# EasyEDA Pro project SchadenDeck.eprj, board Mainboard
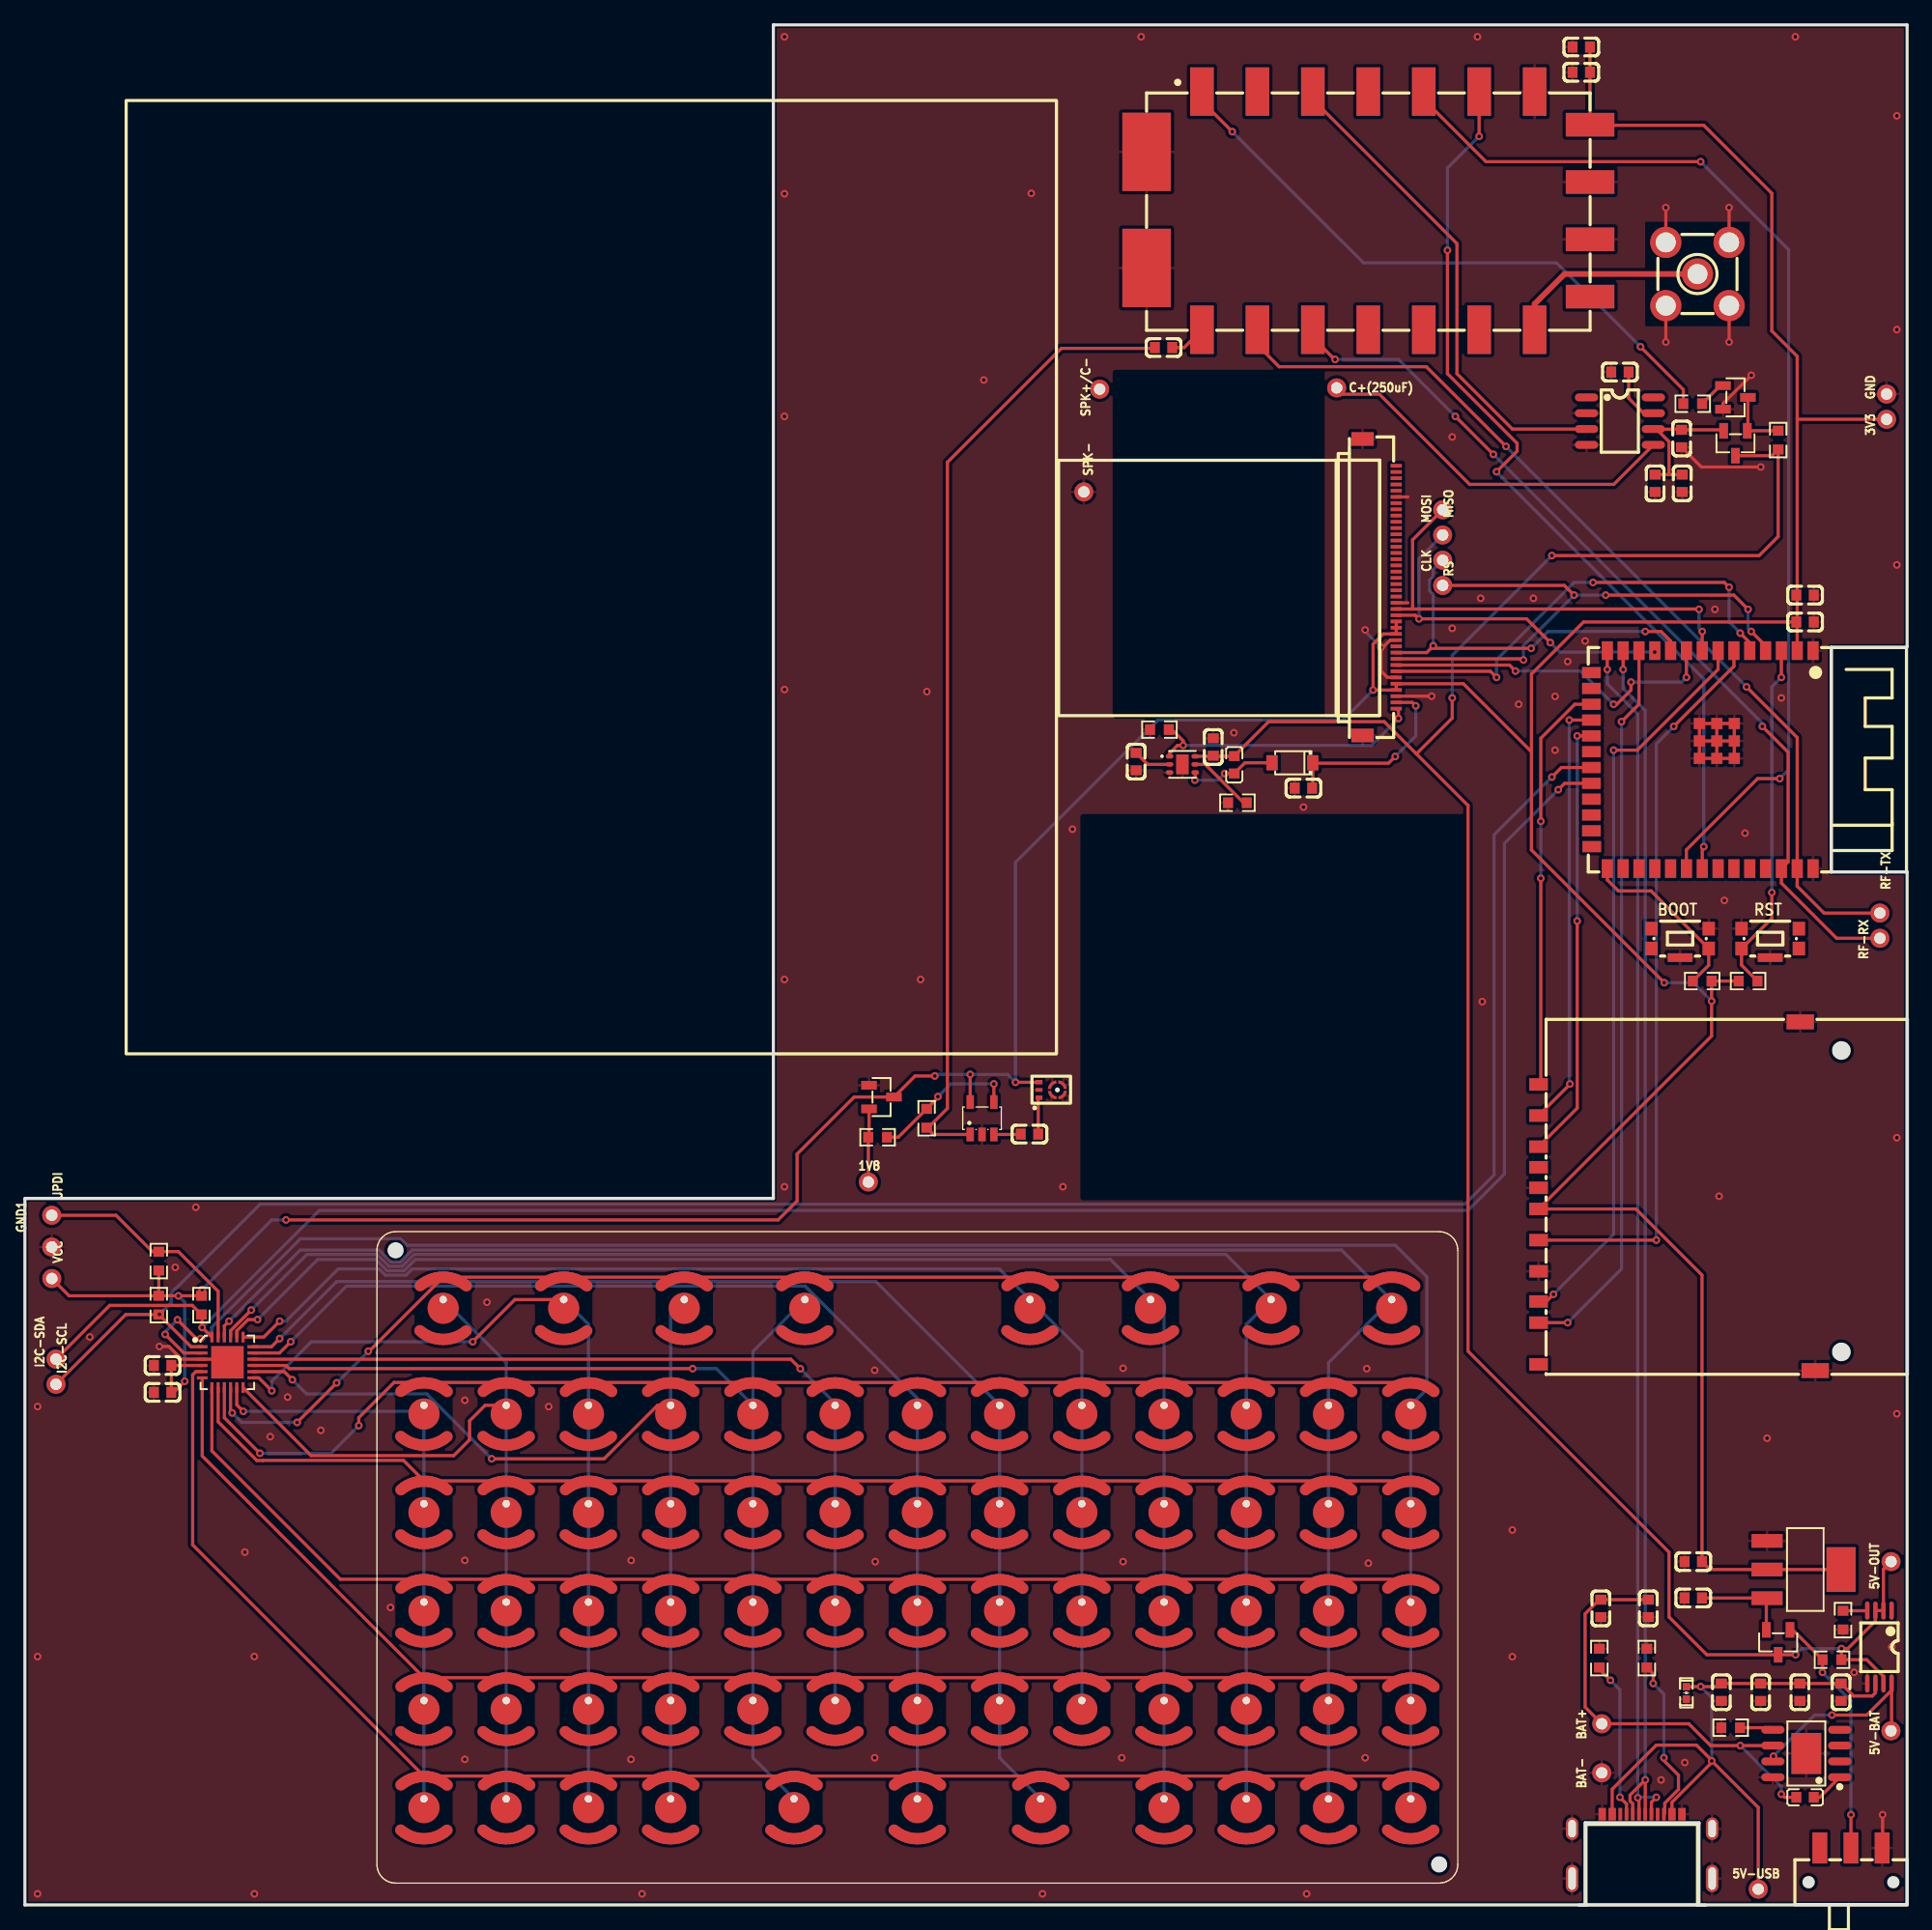
[diagram p4: board, top side]
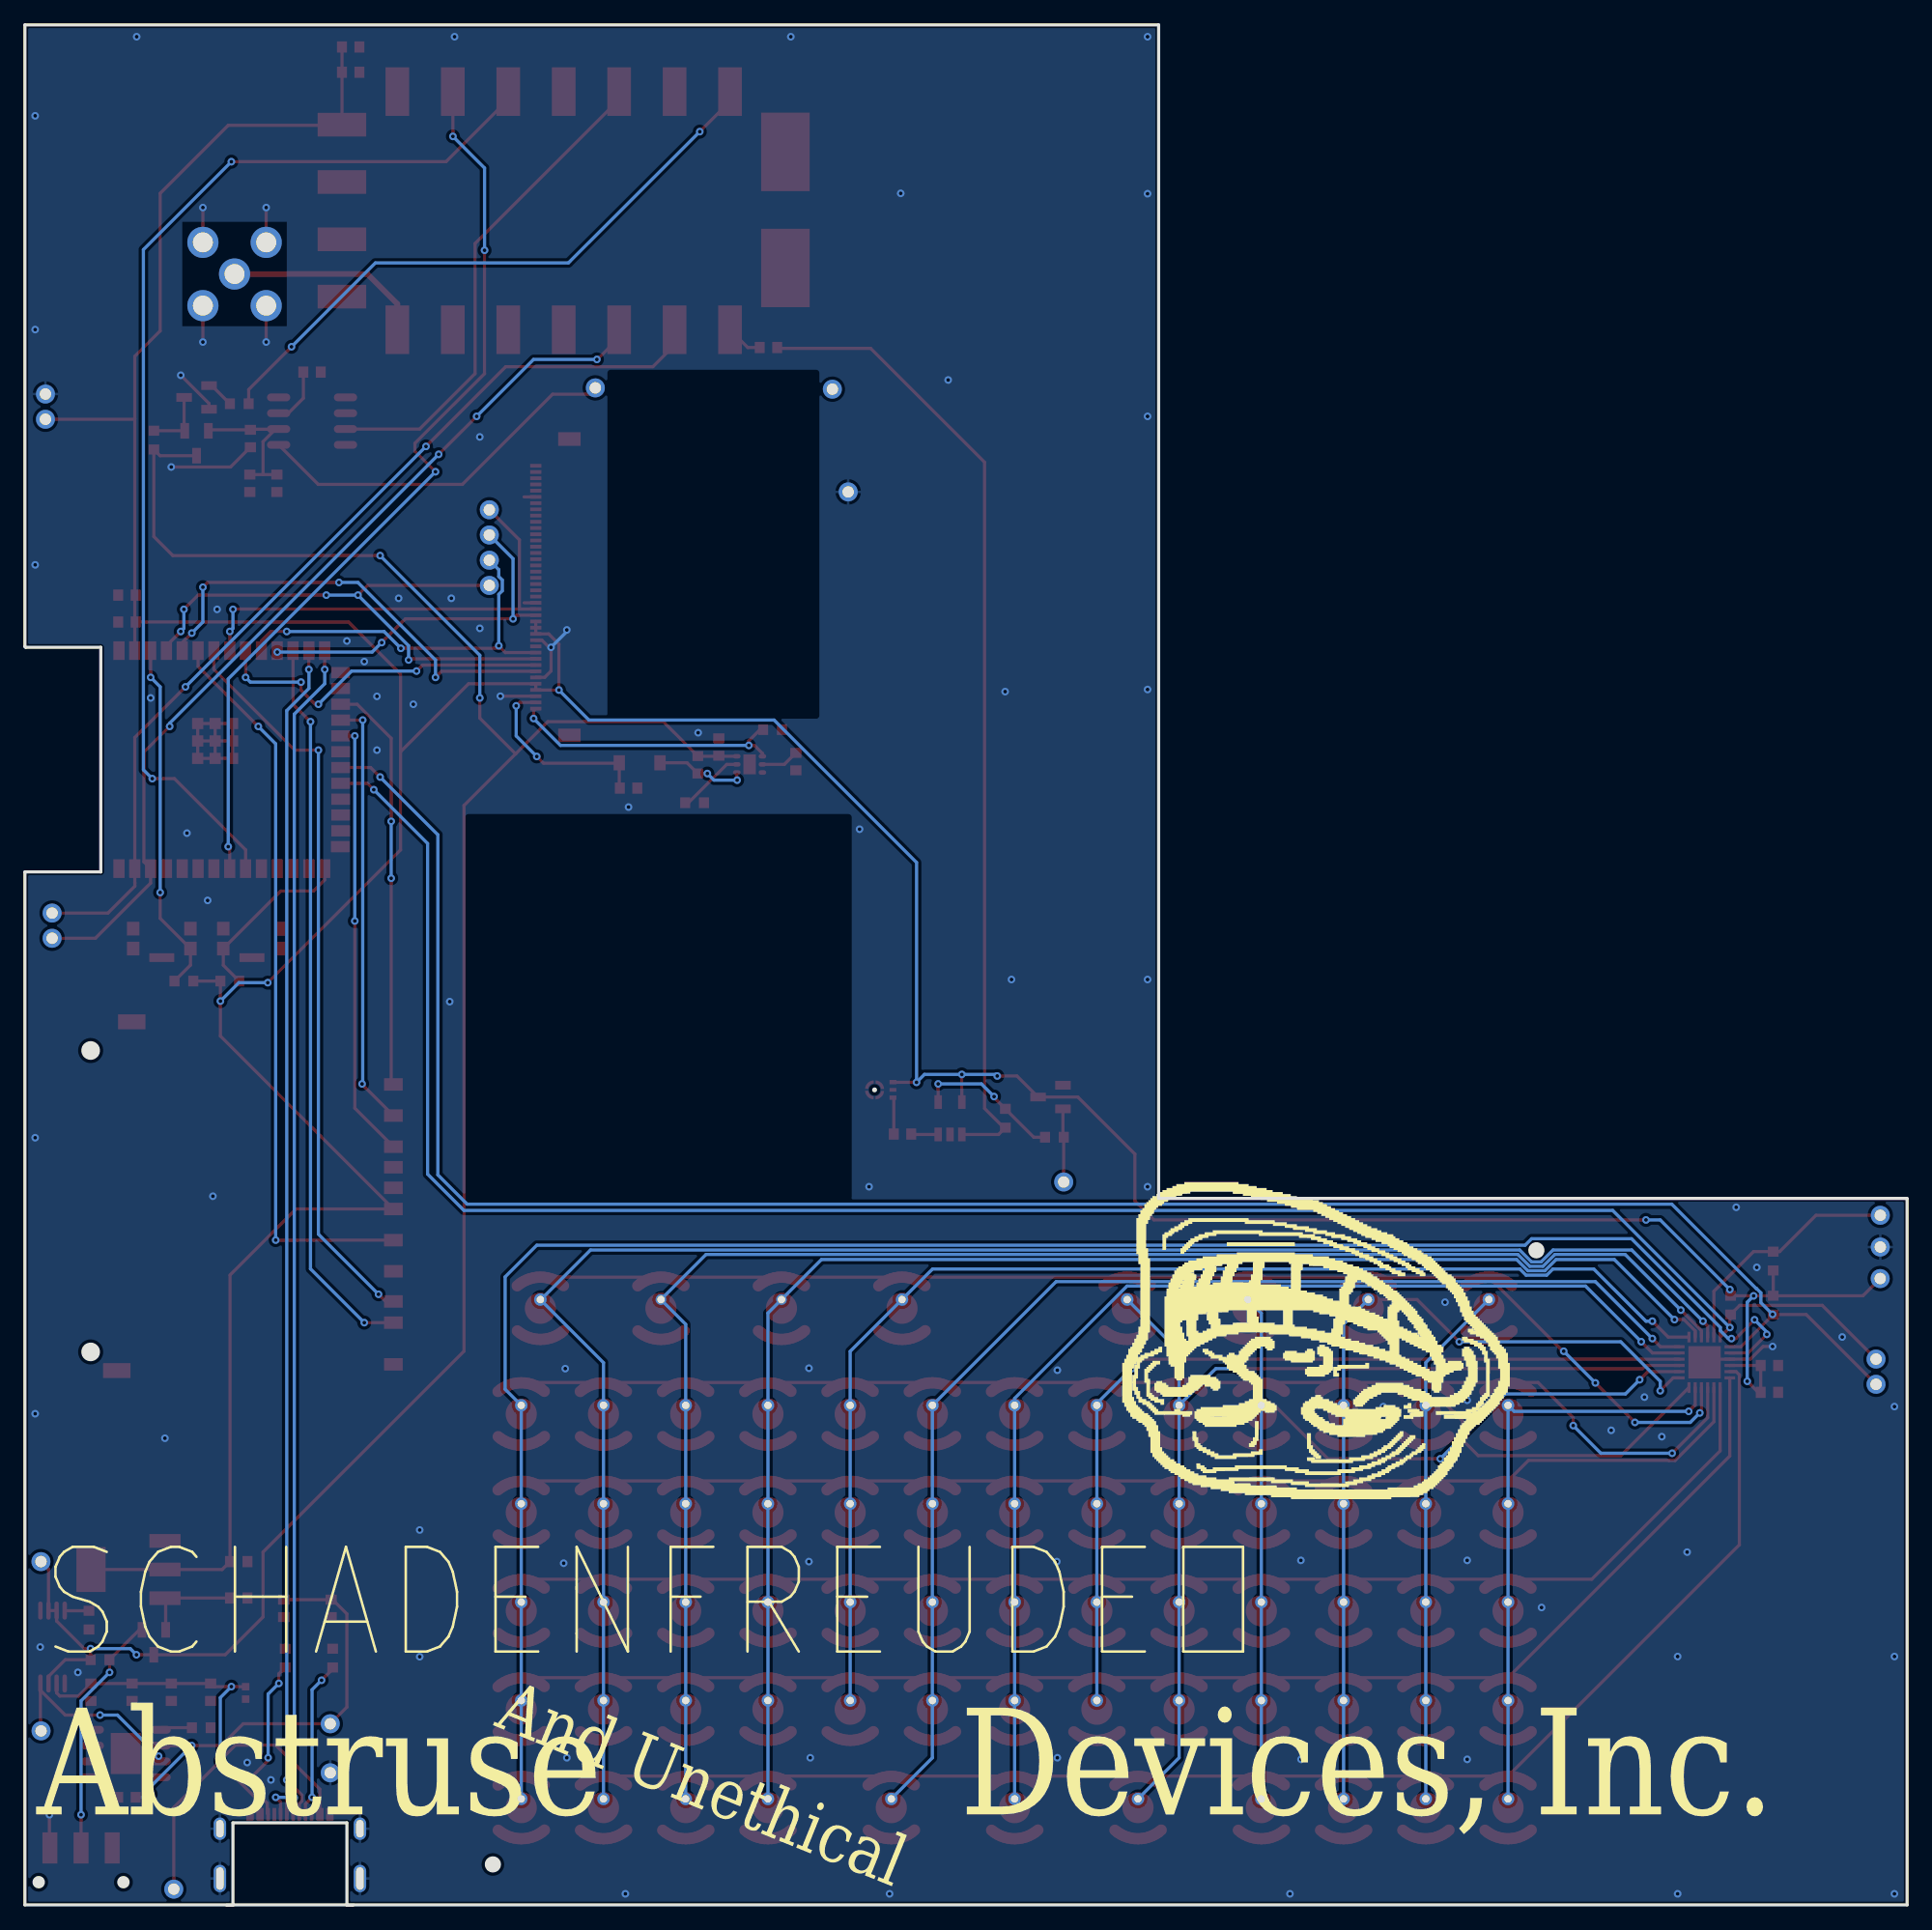
[diagram p5: board, bottom side, seen from below]

Outline 151.06 x 150.95 mm; copper layers: Top Layer, Bottom Layer. Coordinates in mm from the lower left corner of the outline.
Outline path: 0,56.73 60.07,56.73 60.07,150.95 151.06,150.95 151.06,101.04 151,100.98 144.97,100.98 144.97,82.95 151.06,82.95 151.06,0.02 0,0.02 0,56.73
Stack: Top Layer 0.035mm / Dielectric1 1.51mm FR4 er 4.5 / Bottom Layer 0.035mm

## Design rules (mm)
template: JLCPCB Capability(Two Layers Board)
spacing copperThickness1oz (default): track to track 0.102, other pairs 0.152 to 0.3
spacing copperThickness2oz: track to track 0.203, other pairs 0.152 to 0.3
track width copperThickness1oz (default): min 0.127, default 0.254, max 2.54
track width copperThickness2oz: min 0.203, default 0.254, max 2.54
differential pair differentialPair (default): width min 0.127, default 0.254, max 2.54; gap min 0.152, default 0.152
via viaSize (default): diameter min 0.5, default 0.61, max 10; hole min 0.3, default 0.305, max 6.3

## Placement (name value [footprint] x y rotation side)
1V8  PAD  [SMD_BD4.0-L4.0-W4.0-D1.0]  67.69 58.06 0 top
3V3  PAD  [SMD_BD4.0-L4.0-W4.0-D1.0]  149.42 119.29 90 top
5V-BAT  PAD  [SMD_BD4.0-L4.0-W4.0-D1.0]  149.77 13.99 90 top
5V-OUT  PAD  [SMD_BD4.0-L4.0-W4.0-D1.0]  149.78 27.58 180 top
5V-USB  PAD  [SMD_BD4.0-L4.0-W4.0-D1.0]  139.12 1.28 90 top
BAT+  PAD  [SMD_BD4.0-L4.0-W4.0-D1.0]  126.56 14.56 90 top
BAT-  PAD  [SMD_BD4.0-L4.0-W4.0-D1.0]  126.56 10.62 90 top
BOOT  KMR221GLFS  [KEY-SMD_KMR2XXGXXX]  132.84 77.23 180 top
C46  100nF  [C0603]  136.16 17.09 270 top
C47  100nF  [C0603]  139.31 17.09 270 top
C48  10uF  [C0603]  142.46 17.09 270 top
C49  10uF  [C0603]  145.76 17.09 270 top
C50  10uF  [C0603]  130.29 23.82 90 top
C51  10uF  [C0603]  126.48 23.82 90 top
C55  10uF  [C0603]  133.9 27.58 180 top
C56  10uF  [C0603]  133.9 24.66 180 top
C57  4.7uF  [C0603]  95.37 92.98 90 top
C58  1uF  [C0603]  102.62 89.68 180 top
C59  220nF  [C0603]  89.19 91.81 270 top
C60  10uF  [C0603]  142.88 105.17 180 top
C61  1uF  [C0603]  142.88 103.01 180 top
C63  0.1uF  [C0603]  124.92 149.18 180 top
C64  4.7uF  [C0603]  124.92 147.15 180 top
C65  1uF  [C0603]  91.39 125.05 0 top
C66  1uF  [C0603]  80.63 61.9 180 top
C67  100nF  [C0603]  11.05 43.32 180 top
C68  1uF  [C0603]  11.05 41.16 180 top
C69  10uF  [C0603]  128.02 123.08 180 top
C70  100nF  [C0603]  132.97 117.75 90 top
C71  22uF  [C0603]  130.84 114.15 270 top
C72  22uF  [C0603]  133.02 114.15 270 top
C+(250uF)  PAD  [SMD_BD4.0-L4.0-W4.0-D1.0]  105.28 121.81 180 top
CLK  PAD  [SMD_BD4.0-L4.0-W4.0-D1.0]  113.79 107.98 90 top
D2  SLESDPSA0402V05  [D0402-BI]  133.35 17.03 270 top
D5  MBR0540T1G  [SOD-123_L2.7-W1.6-LS3.7-RD]  101.73 91.71 180 top
FPC1  FPC40-T1T1-2021-A  [FPC-SMD_FPC40-T1T1-2021-A]  108.71 105.81 270 top
GND  PAD  [SMD_BD4.0-L4.0-W4.0-D1.0]  149.42 121.31 90 top
GND1  PAD  [SMD_BD4.0-L4.0-W4.0-D1.0]  2.15 52.83 90 top
I2C-SCL  PAD  [SMD_BD4.0-L4.0-W4.0-D1.0]  2.49 41.81 270 top
I2C-SDA  PAD  [SMD_BD4.0-L4.0-W4.0-D1.0]  2.49 43.84 90 top
L3  1uH  [L0603]  142.88 8.65 0 top
L4  10uH  [L0603]  97.06 91.55 270 top
MISO  PAD  [SMD_BD4.0-L4.0-W4.0-D1.0]  113.79 110 270 top
MOSI  PAD  [SMD_BD4.0-L4.0-W4.0-D1.0]  113.79 112.02 90 top
Q1  IRLML6402  [SOT-23-3_L2.9-W1.3-P0.95-LS2.4-BR]  137.29 117.36 90 top
Q2  MMBT3904  [SOT-23-3_L2.9-W1.3-P1.90-LS2.4-BR]  137.29 121.05 180 top
Q3  IRLML6402  [SOT-23-3_L2.9-W1.3-P0.95-LS2.4-BR]  140.72 21.1 90 top
R50  91K  [R0603]  136.91 14.24 0 top
R51  5.1K  [R0603]  126.37 19.83 270 top
R52  5.1K  [R0603]  130.18 19.83 270 top
R59  10K  [R0603]  138.3 74.19 180 top
R60  10K  [R0603]  134.62 74.19 0 top
R61  6.8  [R0603]  91.06 94.38 0 top
R62  100K  [R0603]  97.31 88.5 0 top
R64  68K  [R0603]  72.37 63.17 90 top
R65  10K  [R0603]  68.43 61.65 180 top
R67  4.7K  [R0603]  10.74 48.17 90 top
R69  4.7K  [R0603]  14.17 48.17 90 top
R70  10K  [R0603]  133.86 120.54 180 top
R71  100K  [R0603]  140.72 117.62 270 top
R72  10K  [R0603]  10.74 51.71 270 top
R73  100K  [R0603]  145.03 19.7 0 top
R74  430  [R0603]  145.92 22.88 90 top
RF-RX  PAD  [SMD_BD4.0-L4.0-W4.0-D1.0]  148.88 77.62 90 top
RF-TX  PAD  [SMD_BD4.0-L4.0-W4.0-D1.0]  148.88 79.65 270 top
RS  PAD  [SMD_BD4.0-L4.0-W4.0-D1.0]  113.79 105.95 270 top
RST  KMR221GLFS  [KEY-SMD_KMR2XXGXXX]  140.08 77.23 180 top
SPK+/C-  PAD  [SMD_BD4.0-L4.0-W4.0-D1.0]  86.26 121.71 90 top
SPK-  PAD  [SMD_BD4.0-L4.0-W4.0-D1.0]  84.99 113.46 270 top
SW1  JS102011SAQN  [SW-SMD_JS102011SAQN]  146.56 4.59 0 top
U1  ESPS3-32-N16R8  [WIRELM-SMD_ESP32-S3-WROOM-1]  134.62 91.96 270 top
U2  -  [KeebDeck_Keyboard_6R13C]  71.63 27.58 0 top
U8  ETA9740E8A  [ESOP-8_L4.9-W3.9-P1.27-LS6.0-BL-EP-1]  142.97 12.17 90 top
U11  10067847-001RLF  [SD-SMD_10067847-001RLF]  132.59 56.91 90 top
U14  AMS1117-3.3  [SOT-223-3_L6.5-W3.4-P2.30-LS7.0-BR]  142.79 26.94 180 top
U15  TPS61165DRVR  [WSON-6_L2.0-W2.0-P0.65-TL-EP]  92.9 91.58 0 top
U16  MCP1700T-1802E/TT  [SOT-23-3_L2.9-W1.3-P1.90-LS2.4-BR]  68.75 64.87 180 top
U17  MCP6001OB  [SOT-23-5_L3.0-W1.7-P0.95-LS2.8-BR]  76.82 63.17 270 top
U18  SA818S-U  [WIRELM-SMD_G-NICERF_SA818S-X]  107.82 136.04 0 top
U19  LM386  [SOP-8_L4.9-W3.9-P1.27-LS6.0-BL]  128.02 119.14 270 top
U21  18GHz  [CONN-TH_5P-L6.1-W6.1-P5.08-TL]  134.24 130.95 270 top
U22  LMA2718B381-OAT03  [MIC-SMD_4P-L2.8-W1.9_LMA2718B381-OA7]  82.37 65.45 90 top
U23  ATTINY3217-MFR  [WQFN-24_L4.0-W4.0-P0.50-TL-EP2.6]  16.26 43.58 0 top
U24  TPS2113APWR  [TSSOP-8_L4.4-W3.0-P0.65-LS6.4-BL]  148.84 20.72 180 top
UPDI  PAD  [SMD_BD4.0-L4.0-W4.0-D1.0]  2.15 55.38 270 top
USB3  USBC1-AF-046  [USB-C-SMD_USBC1-AF-046]  129.79 4.72 0 top
VCC  PAD  [SMD_BD4.0-L4.0-W4.0-D1.0]  2.16 50.3 270 top

## Footprints (pads in the part's own frame, mm; a bottom-side part is the same pattern mirrored in y, then rotated)
C0603
  rect 0.8x0.9 smd: 1(-0.7,0) 2(0.7,0)
CONN-TH_5P-L6.1-W6.1-P5.08-TL
  round 2.5 hole 1.6: 1(-2.54,2.54) 2(2.54,2.54) 3(2.54,-2.54) 4(-2.54,-2.54) 5(0,0)
D0402-BI
  rect 0.6x0.6 smd: 1(-0.5,0) 2(0.5,0)
ESOP-8_L4.9-W3.9-P1.27-LS6.0-BL-EP-1
  oval 0.63x1.865 smd: 1(-1.905,-2.683) 2(-0.635,-2.683) 3(0.635,-2.683) 4(1.905,-2.683) 5(1.905,2.683) 6(0.635,2.683) 7(-0.635,2.683) 8(-1.905,2.683)
  rect 3.3x2.4 smd: 9(0,0)
FPC-SMD_FPC40-T1T1-2021-A
  rect 0.3x0.9 smd: 1(-9.75,1.35) 2(-9.25,1.35) 3(-8.75,1.35) 4(-8.25,1.35) 5(-7.75,1.35) 6(-7.25,1.35) 7(-6.75,1.35) 8(-6.25,1.35) 9(-5.75,1.35) 10(-5.25,1.35) 11(-4.75,1.35) 12(-4.25,1.35) 13(-3.75,1.35) 14(-3.25,1.35) 15(-2.75,1.35) 16(-2.25,1.35) 17(-1.75,1.35) 18(-1.25,1.35) 19(-0.75,1.35) 20(-0.25,1.35) 21(0.25,1.35) 22(0.75,1.35) 23(1.25,1.35) 24(1.75,1.35) 25(2.25,1.35) 26(2.75,1.35) 27(3.25,1.35) 28(3.75,1.35) 29(4.25,1.35) 30(4.75,1.35) 31(5.25,1.35) 32(5.75,1.35) 33(6.25,1.35) 34(6.75,1.35) 35(7.25,1.35) 36(7.75,1.35) 37(8.25,1.35) 38(8.75,1.35) 39(9.25,1.35) 40(9.75,1.35)
  rect 1.1x1.8 smd: 41(11.9,-1.35) 42(-11.9,-1.35)
KeebDeck_Keyboard_6R13C
  round 1 hole 0.6: C0(-39.6,12.55) C0(-39.6,4.65) C0(-39.6,-3.25) C0(-39.6,-11.15) C0(-39.6,-19.05) C1(-38.06,21.04) C1(-33,12.55) C1(-33,4.65) C1(-33,-3.25) C1(-33,-11.15) C1(-33,-19.05) C2(-28.385,21.04) C2(-26.4,12.55) C2(-26.4,4.65) C2(-26.4,-3.25) C2(-26.4,-11.15) C2(-26.4,-19.05) C3(-19.8,12.55) C3(-19.8,4.65) C3(-19.8,-3.25) C3(-19.8,-11.15) C3(-19.8,-19.05) C3(-18.71,21.04) C4(-13.2,12.55) C4(-13.2,4.65) C4(-13.2,-3.25) C4(-13.2,-11.15) C4(-9.9,-19.05) C4(-9.035,21.04) C5(-6.6,12.55) C5(-6.6,4.65) C5(-6.6,-3.25) C5(-6.6,-11.15) C6(0,12.55) C6(0,4.65) C6(0,-3.25) C6(0,-11.15) C6(0,-19.05) C7(6.6,12.55) C7(6.6,4.65) C7(6.6,-3.25) C7(6.6,-11.15) C7(9.9,-19.05) C8(9.04,21.04) C8(13.2,12.55) C8(13.2,4.65) C8(13.2,-3.25) C8(13.2,-11.15) C9(19.8,12.55) C9(19.8,4.65) C9(19.8,-3.25) C9(19.8,-11.15) C9(19.8,-19.05) C10(26.4,12.55) C10(26.4,4.65) C10(26.4,-3.25) C10(26.4,-11.15) C10(26.4,-19.05) C11(33,12.55) C11(33,4.65) C11(33,-3.25) C11(33,-11.15) C11(33,-19.05) C11(38.065,21.04) C12(39.6,12.55) C12(39.6,4.65) C12(39.6,-3.25) C12(39.6,-11.15) C12(39.6,-19.05)
  round 2.5 smd: C0(-39.6,11.85) C0(-39.6,3.95) C0(-39.6,-3.95) C0(-39.6,-11.85) C0(-39.6,-19.75) C1(-38.06,20.34) C1(-33,11.85) C1(-33,3.95) C1(-33,-3.95) C1(-33,-11.85) C1(-33,-19.75) C2(-28.385,20.34) C2(-26.4,11.85) C2(-26.4,3.95) C2(-26.4,-3.95) C2(-26.4,-11.85) C2(-26.4,-19.75) C3(-19.8,11.85) C3(-19.8,3.95) C3(-19.8,-3.95) C3(-19.8,-11.85) C3(-19.8,-19.75) C3(-18.71,20.34) C4(-13.2,11.85) C4(-13.2,3.95) C4(-13.2,-3.95) C4(-13.2,-11.85) C4(-9.9,-19.75) C4(-9.035,20.34) C5(-6.6,11.85) C5(-6.6,3.95) C5(-6.6,-3.95) C5(-6.6,-11.85) C6(0,11.85) C6(0,3.95) C6(0,-3.95) C6(0,-11.85) C6(0,-19.75) C7(6.6,11.85) C7(6.6,3.95) C7(6.6,-3.95) C7(6.6,-11.85) C7(9.9,-19.75) C8(9.04,20.34) C8(13.2,11.85) C8(13.2,3.95) C8(13.2,-3.95) C8(13.2,-11.85) C9(18.715,20.34) C9(19.8,11.85) C9(19.8,3.95) C9(19.8,-3.95) C9(19.8,-11.85) C9(19.8,-19.75) C10(26.4,11.85) C10(26.4,3.95) C10(26.4,-3.95) C10(26.4,-11.85) C10(26.4,-19.75) C10(28.39,20.34) C11(33,11.85) C11(33,3.95) C11(33,-3.95) C11(33,-11.85) C11(33,-19.75) C11(38.065,20.34) C12(39.6,11.85) C12(39.6,3.95) C12(39.6,-3.95) C12(39.6,-11.85) C12(39.6,-19.75)
  round 0.85 hole 0.6: C9(18.715,21.04) C10(28.39,21.04)
  round 0.762 smd: R0(-38.06,22.84) R0(-28.392,22.84) R0(-18.718,22.84) R0(-9.043,22.84) R0(9.043,22.84) R0(18.71,22.84) R0(28.385,22.84) R0(38.06,22.84) R1(-39.6,14.382) R1(-33,14.382) R1(-26.4,14.382) R1(-19.8,14.382) R1(-13.2,14.382) R1(-6.6,14.382) R1(0,14.382) R1(6.6,14.382) R1(13.2,14.382) R1(19.8,14.382) R1(26.4,14.382) R1(33,14.382) R1(39.6,14.382) R2(-39.6,6.481) R2(-33,6.481) R2(-26.4,6.481) R2(-19.8,6.481) R2(-13.2,6.481) R2(-6.6,6.481) R2(0,6.481) R2(6.6,6.481) R2(13.2,6.481) R2(19.8,6.481) R2(26.4,6.481) R2(33,6.481) R2(39.6,6.481) R3(-39.6,-1.419) R3(-33,-1.419) R3(-26.4,-1.419) R3(-19.8,-1.419) R3(-13.2,-1.419) R3(-6.6,-1.419) R3(0,-1.419) R3(6.6,-1.419) R3(13.2,-1.419) R3(19.8,-1.419) R3(26.4,-1.419) R3(33,-1.419) R3(39.6,-1.419) R4(-39.6,-9.319) R4(-33,-9.319) R4(-26.4,-9.319) R4(-19.8,-9.319) R4(-13.2,-9.319) R4(-6.6,-9.319) R4(0,-9.319) R4(6.6,-9.319) R4(13.2,-9.319) R4(19.8,-9.319) R4(26.4,-9.319) R4(33,-9.319) R4(39.6,-9.319) R5(-39.6,-17.218) R5(-33,-17.218) R5(-26.4,-17.218) R5(-19.8,-17.218) R5(-9.9,-17.218) R5(0,-17.218) R5(9.9,-17.218) R5(19.8,-17.218) R5(26.4,-17.218) R5(33,-17.218) R5(39.6,-17.218)
KEY-SMD_KMR2XXGXXX
  rect 1x1.1 smd: 1(-2.3,0.438) 2(2.3,0.438) 3(-2.3,-1.162) 4(2.3,-1.162)
  rect 2x0.7 smd: 5(0,1.162)
L0603
  rect 0.8x0.864 smd: 1(-0.7,0) 2(0.7,0)
MIC-SMD_4P-L2.8-W1.9_LMA2718B381-OA7
  rect 0.35x0.55 smd: 1(-0.625,0.977) 3(0.625,0.977)
  rect 0.3x0.55 smd: 2(0,0.977)
  custom 0.686x0.68 smd: 4(-0.479,-0.922) 4(0.479,-0.074)
  custom 0.68x0.686 smd: 4(-0.424,-0.019) 4(0.424,-0.977)
R0603
  rect 0.806x0.864 smd: 1(-0.753,0) 2(0.753,0)
SD-SMD_10067847-001RLF
  rect 1x1.5 smd: 1(6.475,11.1) 2(3.975,11.1) 3(0.675,11.1) 4(-1.025,11.1) 5(-3.525,11.1) 6(-6.025,11.1) 7(-8.45,11.1) 8(-10.15,11.1) 9(8.975,11.1) CD(2.325,11.1) WP(-13.5,11.1)
  rect 1.2x2.2 smd: GND(-14,-11.1) GND(14,-9.9)
SMD_BD4.0-L4.0-W4.0-D1.0
  round 1.524 hole 0.914: 1(0,0)
SOD-123_L2.7-W1.6-LS3.7-RD
  rect 0.91x1.22 smd: 1(-1.635,0) 2(1.635,0)
SOP-8_L4.9-W3.9-P1.27-LS6.0-BL
  oval 0.63x1.865 smd: 1(-1.905,-2.683) 2(-0.635,-2.683) 3(0.635,-2.683) 4(1.905,-2.683) 5(1.905,2.683) 6(0.635,2.683) 7(-0.635,2.683) 8(-1.905,2.683)
SOT-23-3_L2.9-W1.3-P0.95-LS2.4-BR
  rect 1.25x0.7 smd: 1(1,-0.95) 2(1,0.95) 3(-1,0)
SOT-23-3_L2.9-W1.3-P1.90-LS2.4-BR
  rect 1.25x0.7 smd: 1(1,-0.95) 2(1,0.95) 3(-1,0)
SOT-23-5_L3.0-W1.7-P0.95-LS2.8-BR
  rect 1.1x0.6 smd: 1(1.3,-0.95) 2(1.3,0) 3(1.3,0.95) 4(-1.3,0.95) 5(-1.3,-0.95)
SOT-223-3_L6.5-W3.4-P2.30-LS7.0-BR
  rect 2.5x1.1 smd: 1(2.97,-2.3) 2(2.97,0) 3(2.97,2.3)
  rect 2.34x3.6 smd: 4(-2.97,0)
SW-SMD_JS102011SAQN
  rect 1.2x2.5 smd: 1(-2.5,0) 2(0,0) 3(2.5,0)
TSSOP-8_L4.4-W3.0-P0.65-LS6.4-BL
  oval 0.353x1.454 smd: 1(-0.975,-2.927) 2(-0.325,-2.927) 3(0.325,-2.927) 4(0.975,-2.927) 5(0.975,2.927) 6(0.325,2.927) 7(-0.325,2.927) 8(-0.975,2.927)
USB-C-SMD_USBC1-AF-046
  rect 0.6x1 smd: A1B12(-3.2,2.583) A4B9(-2.4,2.583) B1A12(3.2,2.583) B4A9(2.4,2.583)
  rect 0.3x1 smd: A5(-1.25,2.583) A6(-0.25,2.583) A7(0.25,2.583) A8(-1.75,2.583) B5(1.75,2.583) B6(0.75,2.583) B7(-0.75,2.583) B8(1.25,2.583)
  oval 1x1.8 hole 0.6x1.4: EP(-5.62,1.417) EP(5.62,1.417)
  oval 1x2.2 hole 0.6x1.8: EP(-5.62,-2.583) EP(5.62,-2.583)
WIRELM-SMD_ESP32-S3-WROOM-1
  rect 1.5x0.9 smd: 1(-8.75,8.895) 2(-8.75,7.625) 3(-8.75,6.355) 4(-8.75,5.085) 5(-8.75,3.815) 6(-8.75,2.545) 7(-8.75,1.275) 8(-8.75,0.005) 9(-8.75,-1.265) 10(-8.75,-2.535) 11(-8.75,-3.805) 12(-8.75,-5.075) 13(-8.75,-6.345) 14(-8.75,-7.615) 27(8.75,-7.615) 28(8.75,-6.345) 29(8.75,-5.075) 30(8.75,-3.805) 31(8.75,-2.535) 32(8.75,-1.265) 33(8.75,0.005) 34(8.75,1.275) 35(8.75,2.545) 36(8.75,3.815) 37(8.75,5.085) 38(8.75,6.355) 39(8.75,7.625) 40(8.75,8.895)
  rect 0.9x1.5 smd: 15(-6.985,-8.895) 16(-5.715,-8.895) 17(-4.445,-8.895) 18(-3.175,-8.895) 19(-1.905,-8.895) 20(-0.635,-8.895) 21(0.635,-8.895) 22(1.905,-8.895) 23(3.175,-8.895) 24(4.445,-8.895) 25(5.715,-8.895) 26(6.985,-8.865)
  rect 0.9x0.9 smd: 41(-2.9,2.575) 41(-2.9,1.175) 41(-2.9,-0.225) 41(-1.5,2.575) 41(-1.5,1.175) 41(-1.5,-0.225) 41(-0.1,2.575) 41(-0.1,1.175) 41(-0.1,-0.225)
WIRELM-SMD_G-NICERF_SA818S-X
  rect 1.9x3.9 smd: 1(-13.352,9.56) 2(-8.902,9.56) 3(-4.452,9.56) 4(-0.003,9.56) 5(4.447,9.56) 6(8.898,9.56) 7(13.348,9.56) 12(13.348,-9.56) 13(8.898,-9.56) 14(4.447,-9.56) 15(-0.003,-9.56) 16(-4.452,-9.56) 17(-8.902,-9.56) 18(-13.352,-9.56)
  rect 3.9x1.9 smd: 8(17.797,6.9) 9(17.797,2.3) 10(17.797,-2.3) 11(17.797,-6.9)
  rect 3.9x6.3 smd: 19(-17.797,-4.6) 20(-17.797,4.72)
WQFN-24_L4.0-W4.0-P0.50-TL-EP2.6
  rect 0.85x0.25 smd: 1(-2.025,1.25) 2(-2.025,0.75) 3(-2.025,0.25) 4(-2.025,-0.25) 5(-2.025,-0.75) 6(-2.025,-1.25) 13(2.025,-1.25) 14(2.025,-0.75) 15(2.025,-0.25) 16(2.025,0.25) 17(2.025,0.75) 18(2.025,1.25)
  rect 0.25x0.85 smd: 7(-1.25,-2.025) 8(-0.75,-2.025) 9(-0.25,-2.025) 10(0.25,-2.025) 11(0.75,-2.025) 12(1.25,-2.025) 19(1.25,2.025) 20(0.75,2.025) 21(0.25,2.025) 22(-0.25,2.025) 23(-0.75,2.025) 24(-1.25,2.025)
  rect 2.6x2.6 smd: 25(0.001,0)
WSON-6_L2.0-W2.0-P0.65-TL-EP
  oval 0.607x0.364 smd: 1(-1.028,0.65) 2(-1.028,0) 3(-1.028,-0.65) 4(1.028,-0.65) 5(1.028,0) 6(1.028,0.65)
  rect 1x1.6 smd: 7(0,0)

## Nets
As in the schematic, except:
GND: BAT-.1 BOOT.3 BOOT.5 C46.2 C47.2 C48.2 C49.2 C50.1 C51.1 C55.2 C56.2 C57.2 C58.2 C59.2 C60.1 C61.1 C63.2 C64.2 C67.2 C68.2 C69.2 C70.1 C71.2 C72.2 D2.2 FPC1.6 FPC1.23 FPC1.29 FPC1.35 FPC1.38 FPC1.41 FPC1.42 GND.1 GND1.1 Q2.2 R50.1 R51.1 R52.1 R61.1 R62.1 R74.1 RST.4 RST.5 SPK-.1 SW1.3 U1.1 U1.40 U1.41 U8.8 U8.9 U11.3 U11.6 U11.GND U14.1 U15.3 U15.7 U16.1 U17.2 U18.7 U18.9 U18.10 U18.19 U18.20 U19.2 U19.4 U21.1 U21.2 U21.3 U21.4 U22.2 U22.4 U23.3 U23.25 U24.5 USB3.A1B12 USB3.B1A12 USB3.EP

Pads without a net: BOOT 2 4; FPC1 1 2 3 4 5 7 8 9 10 11 12 13 14 15 16 17 18 19 20 21 22 30; RST 1 3; SPK+/C- 1; SW1 1; U1 15 16 23 24 25 26 28 29 30 31 34 35 36 37; U8 2 3 4; U11 CD WP; U18 2 4 11 13 14 15; U19 1 8; U24 1; USB3 A8 B8

## Via types
v1: diameter 0.61, hole 0.305, Top Layer to Bottom Layer, 201 vias

## Routing (per net, layer and track width the routed paths; a pad name or vN(x,y) marks a point on that pad's centre or on a via; arc(x,y) is an arc through that point)
1V8: length 5.9
  Top Layer w0.254: U16.2 67.75,61.72 R65.2 67.69,61.64 1V8.1
3V3: length 382.3
  Top Layer w0.254: R67.2 10.74,50.9 ; R67.2 3.54,48.92 VCC.1 ; R67.2 R69.2 14.17,49.36 v1(14.22,49.42) ; 10.74,50.9 R72.2 ; 10.74,50.9 10.8,50.95 ; C61.2 125.09,103.01 120.91,98.83 120.91,92.6 ; FPC1.26 FPC1.27 FPC1.28 109.03,102.06 108.2,101.24 v1(108.2,97.55) 110.06,97.55 FPC1.37 FPC1.36 115.45,98.06 120.91,92.6 ; 3V3.1 142.26,119.29 142.25,119.31 ; 142.25,119.31 142.25,124.34 140.21,126.38 140.21,137.43 134.75,142.89 125.62,142.89 125.62,142.9 C64.1 C63.1 ; 142.25,119.31 U1.2 ; U14.4 U14.2 135.24,26.94 C55.1 134.6,50.58 129.29,55.89 U11.4 135.37,69.77 v1(135.37,72.58) R60.2 R59.2 ; v1(131.57,74.06) 120.91,84.72 120.91,92.6 ; U23.4 14.23,43.32 11.75,43.32 11.75,41.16 11.94,41.16 v1(12.83,42.05) ; v1(20.95,55.01) 60.45,55.01 61.98,56.53 61.98,60.3 66.55,64.87 U16.3 71.44,66.56 v1(73.03,66.56) ; U22.3 81.38,66.06 v1(79.5,66.06) ; U17.5 v1(75.87,66.69)
  Bottom Layer w0.254: v1(12.83,42.05) 12.83,48.4 v1(12.32,48.91) ; v1(73.03,66.56) 73.15,66.69 v1(75.87,66.69) 78.87,66.69 v1(79.5,66.06) 79.5,83.71 90.93,95.14 105.79,95.14 v1(108.2,97.55) ; v1(135.37,72.58) 133.89,74.06 v1(131.57,74.06) ; v1(20.95,55.01) 19.81,55.01 v1(14.22,49.42)
5V: length 177.5
  Top Layer w0.254: 5V-OUT.1 149.17,26.97 U24.2 U24.3 148.52,22.81 146.3,20.59 v1(145.8,20.59) 145.8,19.71 R73.2 147.83,19.7 149.17,18.36 U24.7 ; v1(114.55,96.92) 114.55,95.3 111.68,92.43 ; 111.68,92.43 109.09,95.01 99.82,95.01 97.04,92.23 U15.6 ; 111.68,92.43 115.82,88.28 115.82,44.47 131.95,28.34 131.95,23.13 134.99,20.1 Q3.3 v1(142.11,20.1) ; Q1.3 140.22,116.36 R71.2 140.72,109.87 139.19,108.35 v1(122.56,108.35)
  Bottom Layer w0.254: v1(145.8,20.59) 142.6,20.59 v1(142.11,20.1) ; v1(122.56,108.35) 114.55,100.35 v1(114.55,96.92)
GND: length 59
  Top Layer w0.254: v1(138.56,122.83) 136.29,120.56 Q2.2 ; 134.4,94.86 U1.41 ; U1.41 135.79,93.46 ; U1.41 U1.41 U1.41 ; U1.41 137.19,92.06 ; U1.41 U1.41 ; FPC1.23 111,104.56 ; FPC1.35 110.05,98.57 109.35,98.57 108.84,99.08 v1(108.84,100.98) 108.99,100.98 109.57,101.56 FPC1.29 ; U21.4 v1(131.7,136.29) ; U1.41 U1.41 ; U1.41 U1.41 ; U1.41 U1.41 ; U1.41 U1.41 U1.41 ; U1.41 U1.41 ; FPC1.6 111,113.06 ; SW1.3 149.1,4.63 v1(149.1,7.26) ; U23.25 16.01,43.83 U23.3 12.57,43.83 11.56,44.85 v1(10.8,44.85) ; U21.2 v1(136.78,125.49) ; U21.3 v1(131.7,125.49) ; U21.1 v1(136.78,136.29) ; C70.1 134.56,115.46 v1(139.32,115.46) ; FPC1.38 v1(112.9,97.06)
  Bottom Layer w0.254: v1(107.57,102.38) 107.57,102.25 v1(108.84,100.98)
  vias: v1(1.02,40.03) v1(1.02,19.96) v1(1.02,0.91) v1(5.21,45.61) v1(12.06,51.2) v1(13.72,56.02) v1(17.65,28.34) v1(18.42,19.96) v1(18.42,0.91) v1(19.69,37.61) v1(21.08,40.78) v1(23.75,38.12) v1(29.34,23.89) v1(35.31,40.53) v1(35.31,27.68) v1(35.31,11.7) v1(37.08,48.4) v1(42.04,40.02) v1(48.64,11.7) v1(48.65,27.68) v1(49.53,0.91) v1(60.96,150) v1(60.96,137.4) v1(60.96,119.52) v1(60.96,97.59) v1(60.96,74.31) v1(60.96,57.67) v1(68.2,42.94) v1(68.25,27.58) v1(68.2,11.83) v1(71.88,74.31) v1(72.39,97.43) v1(76.96,122.44) v1(80.77,137.43) v1(81.67,0.91) v1(83.31,57.67) v1(84.07,86.38) v1(88.03,11.83) v1(88.14,43.1) v1(88.14,27.58) v1(89.59,150) v1(97.03,94.12) v1(102.62,88.16) v1(102.87,0.91) v1(107.57,11.83) v1(107.7,43.07) v1(107.82,27.45) v1(114.55,117.87) v1(114.55,102.51) v1(116.58,150) v1(116.84,104.92) v1(116.97,72.53) v1(119.38,30.12) v1(119.38,19.94) v1(119.89,96.41) v1(121.07,104.92) v1(122.81,97.05) v1(122.81,92.73) v1(123.82,99.84) v1(125.22,101.49) v1(131.32,10.05) v1(133.22,11.45) v1(135.64,104.03) v1(135.98,56.91) v1(136.4,80.66) v1(138.06,86.06) v1(139.83,37.48) v1(140.97,96.92) v1(142.1,150) v1(146.81,18.69) v1(149.84,20.72) v1(150.24,143.65) v1(150.24,126.49) v1(150.24,107.6) v1(150.24,61.61) v1(150.24,39.45)
BAT: length 36
  Top Layer w0.254: v1(140.97,8.91) 141.22,8.65 L3.1 ; U8.6 v1(137.68,12.81) 135.29,12.81 133.54,14.56 BAT+.1 125.22,15.89 125.22,23.38 126.48,24.65 ; C51.2 C50.2
  Bottom Layer w0.254: v1(140.97,8.91) 140.97,9.51 v1(137.68,12.81)
BL_LCD: length 5.4
  Top Layer w0.254: U15.5 93.93,91.58 94.74,91.58 97.81,88.5 R62.2
C0: length 48.4
  Top Layer w0.254: v1(17.53,39.64) 17.01,40.16 U23.11
  Bottom Layer w0.254: U2.C0 U2.C0 U2.C0 U2.C0 U2.C0 31.54,39.64 v1(17.53,39.64)
C1: length 68.1
  Top Layer w0.254: U23.12 22.97,36.09 34.42,36.09 35.69,37.35 35.69,38.88 36.93,40.13 U2.C1
  Bottom Layer w0.254: U2.C1 38.63,43.56 U2.C1 U2.C1 U2.C1 U2.C1 U2.C1
C2: length 69.8
  Top Layer w0.254: v1(35.94,45.23) 39.33,48.62 43.24,48.62 ; U23.13 18.78,42.33 v1(19.81,41.29)
  Bottom Layer w0.254: 43.24,48.62 45.23,46.63 U2.C2 U2.C2 U2.C2 U2.C2 U2.C2 ; v1(35.94,45.23) 22.99,45.23 19.81,42.05 v1(19.81,41.29)
C3: length 78.8
  Top Layer w0.254: v1(37.47,35.83) 46.48,35.83 50.78,40.13 U2.C3 ; v1(21.46,42.18) 20.82,42.83 U23.14
  Bottom Layer w0.254: U2.C3 51.83,47.53 U2.C3 U2.C3 U2.C3 U2.C3 U2.C3 ; v1(21.46,42.18) 22.61,41.04 32.26,41.04 v1(37.47,35.83)
C4: length 84.7
  Top Layer w0.254: v1(53.59,43.07) 21.21,43.07 20.95,43.32 18.28,43.32 U23.15
  Bottom Layer w0.254: U2.C4 U2.C4 U2.C4 U2.C4 58.43,11.83 U2.C4 ; U2.C4 58.43,44.45 U2.C4 ; U2.C4 55.48,43.07 v1(53.59,43.07)
C5: length 72.1
  Top Layer w0.254: v1(62.23,43.07) 61.47,43.83 U23.16
  Bottom Layer w0.254: v1(62.23,43.07) 65.03,40.27 U2.C5 U2.C5 U2.C5 U2.C5
C6: length 91.5
  Top Layer w0.254: U23.17 20.44,44.33 v1(21.34,45.23)
  Bottom Layer w0.254: U2.C6 U2.C6 U2.C6 U2.C6 U2.C6 71.63,40.68 62.61,49.7 25.81,49.7 v1(21.34,45.23)
C7: length 99.2
  Top Layer w0.254: v1(20.45,45.48) 19.79,44.83 U23.18
  Bottom Layer w0.254: v1(20.45,45.48) 25.02,50.06 68.3,50.06 U2.C7 U2.C7 U2.C7 U2.C7 78.23,11.83 U2.C7
C8: length 100.8
  Top Layer w0.254: v1(20.45,46.88) 19.17,45.6 U23.19
  Bottom Layer w0.254: v1(20.45,46.88) 20.95,46.88 25.15,51.07 28.43,51.07 28.93,50.57 30.58,50.57 31.08,51.07 78.21,51.07 U2.C8 84.83,44.46 U2.C8 U2.C8 U2.C8 U2.C8
C9: length 118.8
  Top Layer w0.254: v1(18.67,47.01) 17.9,47.01 17.01,46.11 U23.20
  Bottom Layer w0.254: v1(18.67,47.01) 23.5,51.83 28.17,51.83 29.07,50.93 30.43,50.93 31.34,51.83 87.13,51.83 U2.C9 91.43,47.53 U2.C9 U2.C9 U2.C9 U2.C9 U2.C9
C10: length 129.8
  Top Layer w0.254: U23.21 16.51,46.11 v1(18.16,47.77)
  Bottom Layer w0.254: U2.C10 U2.C10 U2.C10 U2.C10 U2.C10 98.03,46.63 U2.C10 96.4,52.24 31.24,52.24 30.29,51.28 29.22,51.28 28.27,52.24 22.63,52.24 v1(18.16,47.77)
C11: length 141.7
  Top Layer w0.254: v1(16.38,46.88) 16.01,46.5 U23.22
  Bottom Layer w0.254: U2.C11 U2.C11 U2.C11 U2.C11 U2.C11 104.63,43.55 U2.C11 109.64,48.62 105.66,52.59 31.09,52.59 30.14,51.64 29.37,51.64 28.41,52.59 22.1,52.59 v1(16.38,46.88)
C12: length 153.3
  Top Layer w0.254: v1(12.24,46.99) 13.75,45.48 v1(14.1,45.48) ; v1(11.26,45.82) 12.75,44.33 U23.2
  Bottom Layer w0.254: v1(14.1,45.48) 14.35,45.48 14.99,46.12 14.99,46.37 22.11,53.5 30.14,53.5 30.66,52.98 109.98,52.98 112.52,50.44 112.52,41.42 U2.C12 U2.C12 U2.C12 U2.C12 U2.C12 ; v1(11.26,45.82) 11.26,46.01 v1(12.24,46.99)
CLK: length 31.5
  Top Layer w0.254: FPC1.31 112.5,100.56 112.85,100.9 ; 112.85,100.9 v1(120.89,100.9) ; 112.85,100.9 113.03,101.09 v1(113.03,101.11) ; v1(130.05,102.25) 131.32,102.25 132.09,101.48 U1.10
  Bottom Layer w0.254: v1(113.03,101.11) 113.03,105.24 112.75,105.52 112.75,106.38 113.03,106.66 113.03,107.22 CLK.1 ; v1(130.05,102.25) 122.24,102.25 v1(120.89,100.9)
D+: length 97.5
  Top Layer w0.254: USB3.A6 129.54,8.52 v1(129.44,8.62) ; USB3.B6 130.54,8.26 v1(130.94,8.65) ; v1(127,99.2) 127,100.71 U1.14
  Bottom Layer w0.254: v1(127,99.2) 127,98.06 129.44,95.62 v1(129.44,8.62) 129.48,8.65 v1(130.94,8.65)
D-: length 97.5
  Top Layer w0.254: USB3.B7 129.04,8.13 128.83,8.35 128.83,8.83 v1(130.05,10.05) 130.05,7.3 USB3.A7 ; U1.13 v1(128.28,99.2)
  Bottom Layer w0.254: v1(128.28,99.2) 128.27,99.2 128.27,97.68 130.05,95.9 v1(130.05,10.05)
LCD_CS: length 28
  Top Layer w0.254: FPC1.33 119.15,99.56 v1(119.63,99.08) ; v1(128.91,98.19) 128.91,97.55 127.76,96.41 v1(127.51,96.41) ; U1.9 133.35,100.71 v1(133.35,98.57)
  Bottom Layer w0.254: v1(128.91,98.19) 132.97,98.19 v1(133.35,98.57) ; v1(119.63,99.08) 124.84,99.08 v1(127.51,96.41)
LCD_RS: length 46.3
  Top Layer w0.254: v1(126.87,105.17) 137.16,105.17 v1(138.3,104.03) ; U1.4 139.71,101.1 v1(138.56,102.25) ; RS.1 123.55,105.95 v1(124.33,105.17) ; v1(120.27,99.97) 120.18,100.06 FPC1.32
  Bottom Layer w0.254: v1(138.3,104.03) 138.3,102.51 v1(138.56,102.25) ; v1(120.27,99.97) 120.27,101.11 v1(124.33,105.17) v1(126.87,105.17)
LCD_RST: length 36.8
  Top Layer w0.254: v1(136.78,105.81) 136.4,106.19 v1(125.86,106.19) ; FPC1.34 117.62,99.06 v1(118.11,98.57) ; v1(137.67,102.12) 138.44,101.36 U1.5
  Bottom Layer w0.254: v1(136.78,105.81) 136.78,103.01 v1(137.67,102.12) ; v1(118.11,98.57) 118.11,99.97 124.33,106.19 v1(125.86,106.19)
MIC: length 78.4
  Top Layer w0.254: C65.1 90.62,124.98 83.19,124.98 74.04,115.84 74.04,63.96 72.5,62.42 R64.1 72.92,61.87 U17.1
MISO: length 29.5
  Top Layer w0.254: FPC1.25 111.6,103.56 v1(111.89,103.27) 120.52,103.27 v1(122.43,101.36)
  Bottom Layer w0.254: v1(111.89,103.27) 111.89,108.1 MISO.1 ; v1(122.43,101.36) 123.19,100.6 v1(130.81,100.6)
MOSI: length 36.7
  Top Layer w0.254: U1.8 134.62,100.72 v1(134.62,102.25) ; MOSI.1 111.38,109.61 111.38,104.06 ; v1(134.37,104.03) 134.34,104.06 111.38,104.06 ; FPC1.24 111.38,104.06
  Bottom Layer w0.254: v1(134.37,104.03) 134.37,102.51 v1(134.62,102.25)
PTT: length 88.4
  Top Layer w0.254: v1(134.49,139.97) 117.26,139.97 112.27,144.96 ; U1.32 133.35,83.22 133.35,84.73 139.06,90.44 v1(140.84,90.44)
  Bottom Layer w0.254: v1(140.84,90.44) 141.55,91.15 141.55,132.91 v1(134.49,139.97)
R0: length 100.3
  Top Layer w0.254: U23.10 16.51,39.64 v1(16.64,39.51) ; v1(27.56,44.47) 27.62,44.47 U2.R0 U2.R0 U2.R0 U2.R0 U2.R0 U2.R0 U2.R0 U2.R0 ; v1(25.02,41.93) v1(21.84,38.75)
  Bottom Layer w0.254: v1(27.56,44.47) v1(25.02,41.93) ; v1(21.84,38.75) 17.4,38.75 v1(16.64,39.51)
R1: length 101.6
  Top Layer w0.254: U23.9 16.01,39.13 v1(18.86,36.28) ; U2.R1 U2.R1 U2.R1 U2.R1 U2.R1 U2.R1 U2.R1 U2.R1 U2.R1 U2.R1 U2.R1 U2.R1 U2.R1 29.62,41.96 26.8,39.13 v1(26.8,38.5)
  Bottom Layer w0.254: v1(18.86,36.28) 24.57,36.28 v1(26.8,38.5)
R2: length 100.4
  Top Layer w0.254: U23.8 15.51,38.8 18.62,35.69 19.1,35.69 19.11,35.7 30.38,35.7 U2.R2 U2.R2 U2.R2 U2.R2 U2.R2 U2.R2 U2.R2 U2.R2 U2.R2 U2.R2 U2.R2 U2.R2 U2.R2
R3: length 105.6
  Top Layer w0.254: U23.7 15.01,36.47 25.31,26.16 U2.R3 U2.R3 U2.R3 U2.R3 U2.R3 U2.R3 U2.R3 U2.R3 U2.R3 U2.R3 U2.R3 U2.R3 U2.R3
R4: length 110.6
  Top Layer w0.254: U2.R4 U2.R4 U2.R4 U2.R4 U2.R4 U2.R4 U2.R4 U2.R4 U2.R4 U2.R4 U2.R4 U2.R4 U2.R4 14.23,36.05 U23.6
R5: length 120
  Top Layer w0.254: U23.5 13.72,42.83 13.46,42.57 13.46,28.92 U2.R5 U2.R5 U2.R5 U2.R5 U2.R5 U2.R5 U2.R5 U2.R5 U2.R5 U2.R5 U2.R5
RF_PD: length 72.7
  Top Layer w0.254: v1(114.17,132.86) 114.17,122.95 119.76,117.36 119.76,116.73 v1(118.11,115.08) ; v1(134.75,84.98) 134.62,84.86 U1.33 ; 116.72,144.96 116.71,144.96 v1(116.71,142)
  Bottom Layer w0.254: v1(134.75,84.98) 134.75,98.44 v1(118.11,115.08) ; v1(114.17,132.86) 114.17,139.46 v1(116.71,142)
RF_RXD: length 72.6
  Top Layer w0.254: v1(105.16,124.1) 105.12,124.1 103.37,125.84 ; RF-RX.1 145.41,77.62 140.97,82.05 U1.38 141.52,83.76 141.52,92.56 v1(139.45,94.63) ; v1(114.81,119.52) v1(117.86,116.48)
  Bottom Layer w0.254: v1(117.86,116.48) 139.45,94.89 v1(139.45,94.63) ; v1(105.16,124.1) 110.24,124.1 v1(114.81,119.52)
RF_TXD: length 76.4
  Top Layer w0.254: v1(118.87,117.11) 112.47,123.51 100.66,123.51 98.92,125.25 98.92,125.84 ; RF-TX.1 144.4,79.65 142.24,81.8 142.24,82.06 142.25,82.06 U1.39 142.25,93.74 v1(138.18,97.81)
  Bottom Layer w0.254: v1(138.18,97.81) v1(118.87,117.11)
SCL: length 164.8
  Top Layer w0.254: v1(10.8,47.43) 10.75,47.43 R67.1 ; U23.1 13.33,44.83 R67.1 ; I2C-SCL.1 8.09,47.41 R67.1 ; v1(122.56,90.57) 123.32,91.33 U1.21
  Bottom Layer w0.254: v1(10.8,47.43) 11.73,48.37 11.73,49.15 12.08,49.5 12.1,49.5 18.88,56.28 115.57,56.28 117.92,58.63 117.92,85.93 v1(122.56,90.57)
SD_CLK: length 59.4
  Top Layer w0.254: U1.6 137.16,99.46 v1(132.33,94.63) ; U11.5 v1(130.94,53.39)
  Bottom Layer w0.254: v1(130.94,53.39) 130.94,93.23 v1(132.33,94.63)
SD_CMD: length 35.4
  Top Layer w0.254: v1(124.59,79.01) 124.59,63.99 U11.2 ; v1(124.59,93.87) U1.19
  Bottom Layer w0.254: v1(124.59,79.01) v1(124.59,93.87)
SD_D0: length 59.7
  Top Layer w0.254: v1(127.51,92.73) 129.41,92.73 135.9,99.21 U1.7 ; U11.7 122.11,48.46 v1(122.68,49.04)
  Bottom Layer w0.254: v1(122.68,49.04) 127.51,53.86 v1(127.51,92.73)
SD_D1: length 58.7
  Top Layer w0.254: U11.8 v1(123.82,46.76) ; v1(128.14,95.01) 129.54,96.41 129.54,100.71
  Bottom Layer w0.254: v1(128.14,95.01) 128.14,51.08 v1(123.82,46.76)
SD_D2: length 33.1
  Top Layer w0.254: v1(121.67,82.44) 121.67,66.07 U11.9 ; v1(121.67,87.01) 121.67,93.68 124.4,96.41 U1.17
  Bottom Layer w0.254: v1(121.67,82.44) v1(121.67,87.01)
SD_D3: length 34.6
  Top Layer w0.254: v1(124,65.93) 124,65.9 U11.1 ; 125.72,95.14 v1(123.95,95.14)
  Bottom Layer w0.254: v1(123.95,95.14) 123.95,65.98 v1(124,65.93)
SDA: length 161.1
  Top Layer w0.254: U23.24 14.24,46.37 v1(14.22,46.37) 14.22,47.36 R69.1 13.43,48.15 6.81,48.15 I2C-SDA.1 ; 125.72,90.06 123.57,90.06 v1(123.06,89.55)
  Bottom Layer w0.254: v1(14.22,46.37) 23.62,55.77 115.82,55.77 118.75,58.69 118.75,85.23 v1(123.06,89.55)
$1N2501: length 14.5
  Top Layer w0.254: R60.1 135.14,75.46 BOOT.1 130.51,81.42 127.89,81.42 127,82.31 U1.27
$1N2530: length 28.4
  Top Layer w0.254: v1(140.21,81.3) 140.21,79.23 RST.2 137.78,75.46 R59.1 ; v1(140.97,98.57) 140.97,100.71 U1.3
  Bottom Layer w0.254: v1(140.97,98.57) 140.21,97.81 v1(140.21,81.3)
$1N4339: length 13.3
  Top Layer w0.254: R52.2 130.68,18.57 v1(130.68,17.8) ; v1(131.54,11.83) 131.54,11.6 132.72,10.43 132.72,9.28 131.62,8.18 131.62,7.37 USB3.B5
  Bottom Layer w0.254: v1(131.54,11.83) 131.54,16.94 v1(130.68,17.8)
$1N4352: length 2.7
  Top Layer w0.254: U8.5 140.13,14.24 R50.2
$1N4388: length 2.8
  Top Layer w0.254: U8.1 144.05,8.65 L3.2
$1N6687: length 12.7
  Top Layer w0.254: R51.2 126.37,18.94 v1(127.25,18.05) ; v1(128.02,8.65) 128.54,8.12 USB3.A5
  Bottom Layer w0.254: v1(128.02,8.65) 128.02,17.29 v1(127.25,18.05)
$1N9353: length 7.8
  Top Layer w0.254: C56.1 139.81,24.66 U14.3 139.77,24.59 Q3.2
$1N12779: length 19.7
  Top Layer w0.254: SW1.2 v1(146.56,7.26) ; v1(144.27,18.69) 144.27,19.69 R73.1 141.88,22.1 Q3.1
  Bottom Layer w0.254: v1(144.27,18.69) 146.56,16.4 v1(146.56,7.26)
$1N13089: length 15.9
  Top Layer w0.254: 5V-BAT.1 149.82,14.04 149.82,17.25 ; v1(145.03,15.26) 147.83,15.26 149.82,17.25 ; 149.82,17.25 U24.8 ; U8.7 140.34,11.58 v1(140.34,11.95)
  Bottom Layer w0.254: v1(145.03,15.26) 143.64,15.26 v1(140.34,11.95)
$1N13109: length 52.4
  Top Layer w0.254: 135.45,11.51 135.47,11.54 134.16,12.84 130.94,12.84 127.39,9.3 USB3.A4B9 ; 135.45,11.51 139.12,7.84 5V-USB.1 ; 135.45,11.51 v1(135.38,11.57) ; 135.45,11.51 132.19,8.26 USB3.B4A9 ; D2.1 135.9,17.53 C46.1 C47.1 C48.1 C49.1 146.77,16.78 148.26,16.78 148.52,17.04 U24.6
  Bottom Layer w0.254: v1(135.38,11.57) 135.38,16.65 v1(134.49,17.54)
$1N13229: length 2
  Top Layer w0.254: U24.4 147.85,23.63 R74.2
$6N6275: length 19.6
  Top Layer w0.254: U23.23 15.51,49.28 12.32,52.47 10.23,52.47 7.31,55.38 UPDI.1
$7N1968: length 7.4
  Top Layer w0.254: D5.2 97.92,91.71 L4.2 97.06,90.85 v1(96.29,90.85) ; v1(93.9,90.32) 93.93,90.35 U15.4
  Bottom Layer w0.254: v1(96.29,90.85) 95.76,90.32 v1(93.9,90.32)
$7N2138: length 15.3
  Top Layer w0.254: v1(109.98,92.22) 109.44,91.68 103.39,91.68 D5.1 103.36,89.72 C58.1 ; v1(111.63,96.28) 111.36,96.56 FPC1.39
  Bottom Layer w0.254: v1(111.63,96.28) 111.63,93.87 v1(109.98,92.22)
$7N2168: length 22.6
  Top Layer w0.254: FPC1.40 110.24,95.88 v1(110.24,95.27) ; U15.1 91.87,92.47 92.51,93.11 v1(92.96,93.11) 92.96,93.47 91.81,94.63
  Bottom Layer w0.254: v1(110.24,95.27) 108.08,93.11 v1(92.96,93.11)
$7N2271: length 3.1
  Top Layer w0.254: C59.1 90.11,91.58 U15.2
$8N1477: length 39
  Top Layer w0.254: 103.37,144.96 114.94,133.4 114.94,122.95 119.38,118.51 U19.3
$8N1633: length 29.7
  Top Layer w0.254: 105.28,121.3 108.71,121.3 115.95,114.06 127.52,114.06 U19.5
$8N2011: length 16.8
  Top Layer w0.45: U21.5 123.57,130.95 121.17,128.55 121.17,125.84
$8N2442: length 11.9
  Top Layer w0.254: U17.4 v1(77.77,65.93) ; v1(73.28,64.91) 73.28,64.83 R64.2 70.09,61.65 R65.1
  Bottom Layer w0.254: v1(73.28,64.91) 74.29,65.93 v1(77.77,65.93)
$8N2615: length 2.2
  Top Layer w0.254: U17.3 79.9,61.87 C66.2
$8N2619: length 2.9
  Top Layer w0.254: C66.1 81.33,64.76 U22.1
$8N2632: length 3
  Top Layer w0.254: U18.18 93.04,125.05 C65.2
$8N3977: length 11.7
  Top Layer w0.254: C70.2 136.26,118.45 136.34,118.36 ; U19.6 130.94,118.51 131.95,117.49 131.95,114.86 131.94,114.85 ; 131.94,114.85 C72.1 ; 131.94,114.85 C71.1 ; 132.91,118.49 131.08,118.49
$8N4519: length 2.3
  Top Layer w0.254: R70.1 136.07,122 Q2.1
$8N4602: length 49.5
  Top Layer w0.254: R70.2 133.1,121.67 v1(129.67,125.11) ; v1(96.9,142.38) 94.47,144.81 94.47,144.96
  Bottom Layer w0.254: v1(96.9,142.38) 107.44,131.84 122.94,131.84 v1(129.67,125.11)
$8N4635: length 5.1
  Top Layer w0.254: R71.1 138.29,118.37 ; 138.29,118.37 Q2.3 ; 138.29,118.37 138.24,118.37
$8N4810: length 4.6
  Top Layer w0.254: C69.1 128.72,120.98 129.92,119.78 U19.7

## Copper pours and planes (outline as drawn; the poured copper is in the pictures)
GND on Top Layer: -1.02,151.78 151.51,151.78 151.51,-0.36 -1.02,-0.36
GND on Bottom Layer: -1.14,151.4 151.51,151.4 151.51,-0.49 -1.14,-0.49

## Text on the board
Bottom Silkscreen Layer: SCHADENFREUDE™ | And Unethical | Abstruse         Devices, Inc.
